# EAGLE design Oraculo V2 (EAGLE 9.4.0)
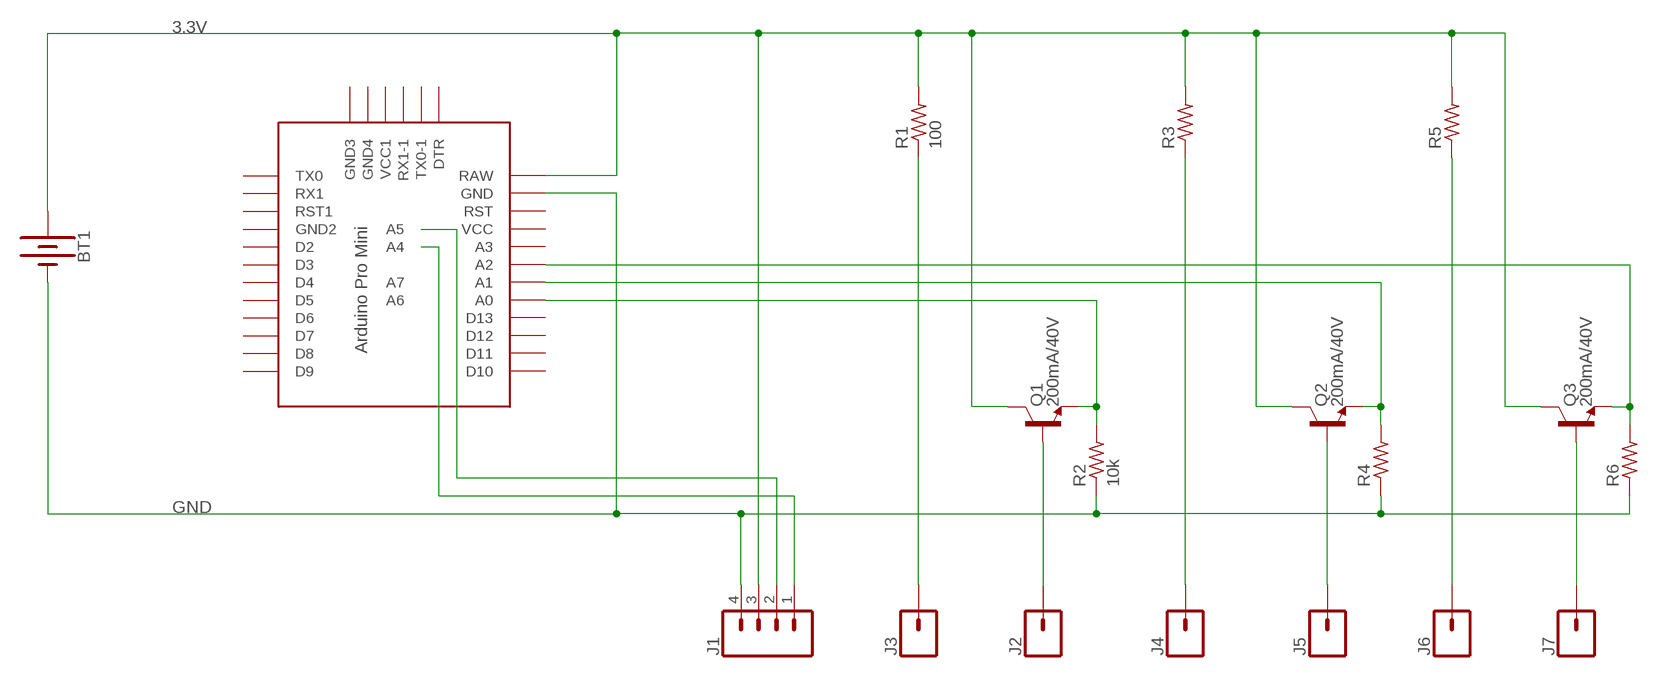
[diagram p0: schematic, sheet 1]

## Parts
BT1  BATTERY-20MM_PTH  [BATTCOM_20MM_PTH]
J1  CONN_04  [1X04]
J2  CONN_01PTH_2MM  [1X01_2MM]
J3  CONN_01PTH_2MM  [1X01_2MM]
J4  CONN_01PTH_2MM  [1X01_2MM]
J5  CONN_01PTH_2MM  [1X01_2MM]
J6  CONN_01PTH_2MM  [1X01_2MM]
J7  CONN_01PTH_2MM  [1X01_2MM]
Q1  200mA/40V  TRANS_NPN-2N3904  [TO-92]
Q2  200mA/40V  TRANS_NPN-2N3904  [TO-92]
Q3  200mA/40V  TRANS_NPN-2N3904  [TO-92]
R1  100  R-US_0204/7  [0204/7]
R2  10k  R-US_0204/7  [0204/7]
R3  R-US_0204/7  [0204/7]
R4  R-US_0204/7  [0204/7]
R5  R-US_0204/7  [0204/7]
R6  R-US_0204/7  [0204/7]
U$1  PRO-MINI-2  [PRO-MINI-2]

## Nets
3.3V: BT1.1(+) J1.3 Q1.3(C) Q2.3(C) Q3.3(C) R1.2 R3.2 R5.2 U$1.RAW
GND: BT1.2(-) J1.4 R2.1 R4.1 R6.1 U$1.GND
N$3: J1.2 U$1.A5
N$4: J1.1 U$1.A4
N$5: Q1.1(E) R2.2 U$1.A0
N$6: J2.1 Q1.2(B)
N$7: J3.1 R1.1
N$8: J4.1 R3.1
N$9: J7.1 Q3.2(B)
N$10: J5.1 Q2.2(B)
N$11: Q2.1(E) R4.2 U$1.A1
N$12: Q3.1(E) R6.2 U$1.A2
N$14: J6.1 R5.1
Unconnected: U$1.A3 U$1.A6 U$1.A7 U$1.D2 U$1.D3 U$1.D4 U$1.D5 U$1.D6 U$1.D7 U$1.D8 U$1.D9 U$1.D10 U$1.D11 U$1.D12 U$1.D13 U$1.DTR U$1.GND1(GND2) U$1.GND2(GND3) U$1.GND3(GND4) U$1.RST U$1.RST1 U$1.RX1 U$1.RX1-1 U$1.TX0 U$1.TX0-1 U$1.VCC U$1.VCC1

## Library data of the parts
BT1 = SparkFun-Batteries:BATTERY: Battery - Single Cell A variety of battery chemistries, sizes, and footprints. Device List: 20MM_PTH - Coin Cell Battery Holder - 20mm (PTH) <https://www.sparkfun.com/products/783> 6.8MM_PTH - Coin Cell Battery Holder - 6.8MM(SMD) <https://www.digikey.com/product-detail/en/seiko-instruments/MS621FE-FL11E/728-1057-ND/1889208?WT.srch=1&gclid=CNOQ5a6LzdQCFZS2wAodXCkE0g> 12MM_SMD - Coin Cell Battery Holder - 12mm (SMD) <https://www.sparkfun.com/products/10592> 12MM_PTH - Coin Cell Battery Holder - 12mm (PTH) <https://www.sparkfun.com/products/7948> 20MM_SMD - 20mm Coin Cell Battery Holder (SMD) (2 legs) Used on the Big Time Watch Kit <https://www.sparkfun.com/products/11734> 20MM_SMD_4LEGS - Coin Cell Battery Holder - 20mm (SMD) <https://www.sparkfun.com/products/11892> 20MM_SMD_4LEGS_OVERPASTE - Coin Cell Battery Holder - 20mm (SMD) <https://www.sparkfun.com/products/11892> (Over-paste on the legs) 24.5MM_PTH - Coin Cell Battery Holder - 24.5mm (PTH) <https://www.sparkfun.com/products/8863> 9V - 9V Battery Holder - PC Mount Used on the SparkFun SparkPunk Sound Kit <https://www.sparkfun.com/products/11177> and SparkFun SparkPunk Sequencer Kit <https://www.sparkfun.com/products/12707> 18650 - Battery Holder - 18650 (PTH) <https://www.sparkfun.com/products/13113> AA - Battery Holder - 1xAA (PTH) <https://www.sparkfun.com/products/7949> AAA - Battery Holder - 1xAAA (PTH) <https://www.sparkfun.com/products/12718> AA_KIT - Battery Holder - 1xAA (PTH) <https://www.sparkfun.com/products/7949> Special kit package - pads only have exposed copper on one side of the board. AAA_KIT - Battery Holder - 1xAAA (PTH) <https://www.sparkfun.com/products/12718> Special kit package - pads only have exposed copper on one side of the board.; PROD_ID: BATT-09031; SF_SKU: PRT-00783
J1 = SparkFun-Connectors:CONN_04: Multi connection point. Often used as Generic Header-pin footprint for 0.1 inch spaced/style header connections On any of the 0.1 inch spaced packages, you can populate with these: Break Away Headers - Straight <https://www.sparkfun.com/products/116> (PRT-00116) Break Away Male Headers - Right Angle <https://www.sparkfun.com/products/553> (PRT-00553) Female Headers <https://www.sparkfun.com/products/115> (PRT-00115) Break Away Headers - Machine Pin <https://www.sparkfun.com/products/117> (PRT-00117) Break Away Female Headers - Swiss Machine Pin <https://www.sparkfun.com/products/743> (PRT-00743) For SCREWTERMINALS and SPRING TERMINALS visit here: Screw Terimnals on SparkFun.com <https://www.sparkfun.com/search/results?term=Screw+Terminals> (5mm/3.5mm/2.54mm spacing) This device is also useful as a general connection point to wire up your design to another part of your project. Our various solder wires solder well into these plated through hole pads. Hook-Up Wire - Assortment (Stranded, 22 AWG) <https://www.sparkfun.com/products/11375> (PRT-11375) Hook-Up Wire - Assortment (Solid Core, 22 AWG) <https://www.sparkfun.com/products/11367> (PRT-11367) View the entire wire category on our website here <https://www.sparkfun.com/categories/141> Special notes: Molex polarized connector foot print use with SKU : PRT-08231 with associated crimp pins and housings. 1MM SMD Version SKU: PRT-10208; PROD_ID: CONN-09696
J2-J7 = SparkFun-Connectors:CONN_01: Single connection point. Often used as Generic Header-pin footprint for 0.1 inch spaced/style header connections On any of the 0.1 inch spaced packages, you can populate with these: Break Away Headers - Straight <https://www.sparkfun.com/products/116> (PRT-00116) Break Away Male Headers - Right Angle <https://www.sparkfun.com/products/553> (PRT-00553) Female Headers <https://www.sparkfun.com/products/115> (PRT-00115) Break Away Headers - Machine Pin <https://www.sparkfun.com/products/117> (PRT-00117) Break Away Female Headers - Swiss Machine Pin <https://www.sparkfun.com/products/743> (PRT-00743) This device is also useful as a general connection point to wire up your design to another part of your project. Our various solder wires solder well into these plated through hole pads. Hook-Up Wire - Assortment (Stranded, 22 AWG) <https://www.sparkfun.com/products/11375> (PRT-11375) Hook-Up Wire - Assortment (Solid Core, 22 AWG) <https://www.sparkfun.com/products/11367> (PRT-11367) View the entire wire category on our website here <https://www.sparkfun.com/categories/141> Special notes: SMTSO-256-ET is a "flush mount" nut for a 4-40 screw. We mostly use this on specialty testbeds; it is a nice way to connect hardware to your PCB at an adjustable hieght. Also note, the SNAP packages are for using a snappable style connector. We sell a baggie of snaps and they are also used on two LilyPad designs: Snap Assortment - 30 pack (male and female) <https://www.sparkfun.com/products/11347> (DEV-11347) LilyPad Arduino SimpleSnap <https://www.sparkfun.com/products/10941> (DEV-10941) LilyPad SimpleSnap Protoboard <https://www.sparkfun.com/products/10940> (DEV-10940)
Q1-Q3 = SparkFun-DiscreteSemi:TRANS_NPN: NPN transistor Current controlled devices typically used to amplify current or used as a switch. BC547 - COM-08928 <http://www.sparkfun.com/products/8928> (TO-92 45V 100mA) (1.Collector 2.Base 3.Emitter) 2N3904 - COM-00521 <http://www.sparkfun.com/products/521> (TO-92 40V 200mA) (1.Emitter 2.Base 3.Collector) P2N2222A - COM-12852 <http://www.sparkfun.com/products/12852> (TO-92 40V 600mA) (1.Collector 2.Base 3.Emitter); PROD_ID: TRANS-08447
R1-R6 = rcl:R-US_: RESISTOR, American symbol; SPICEPREFIX: R
U$1 = Arduino-clone:PRO-MINI-2: Arduino Pro Mini Layout 2 Sparkfun.com

## Board
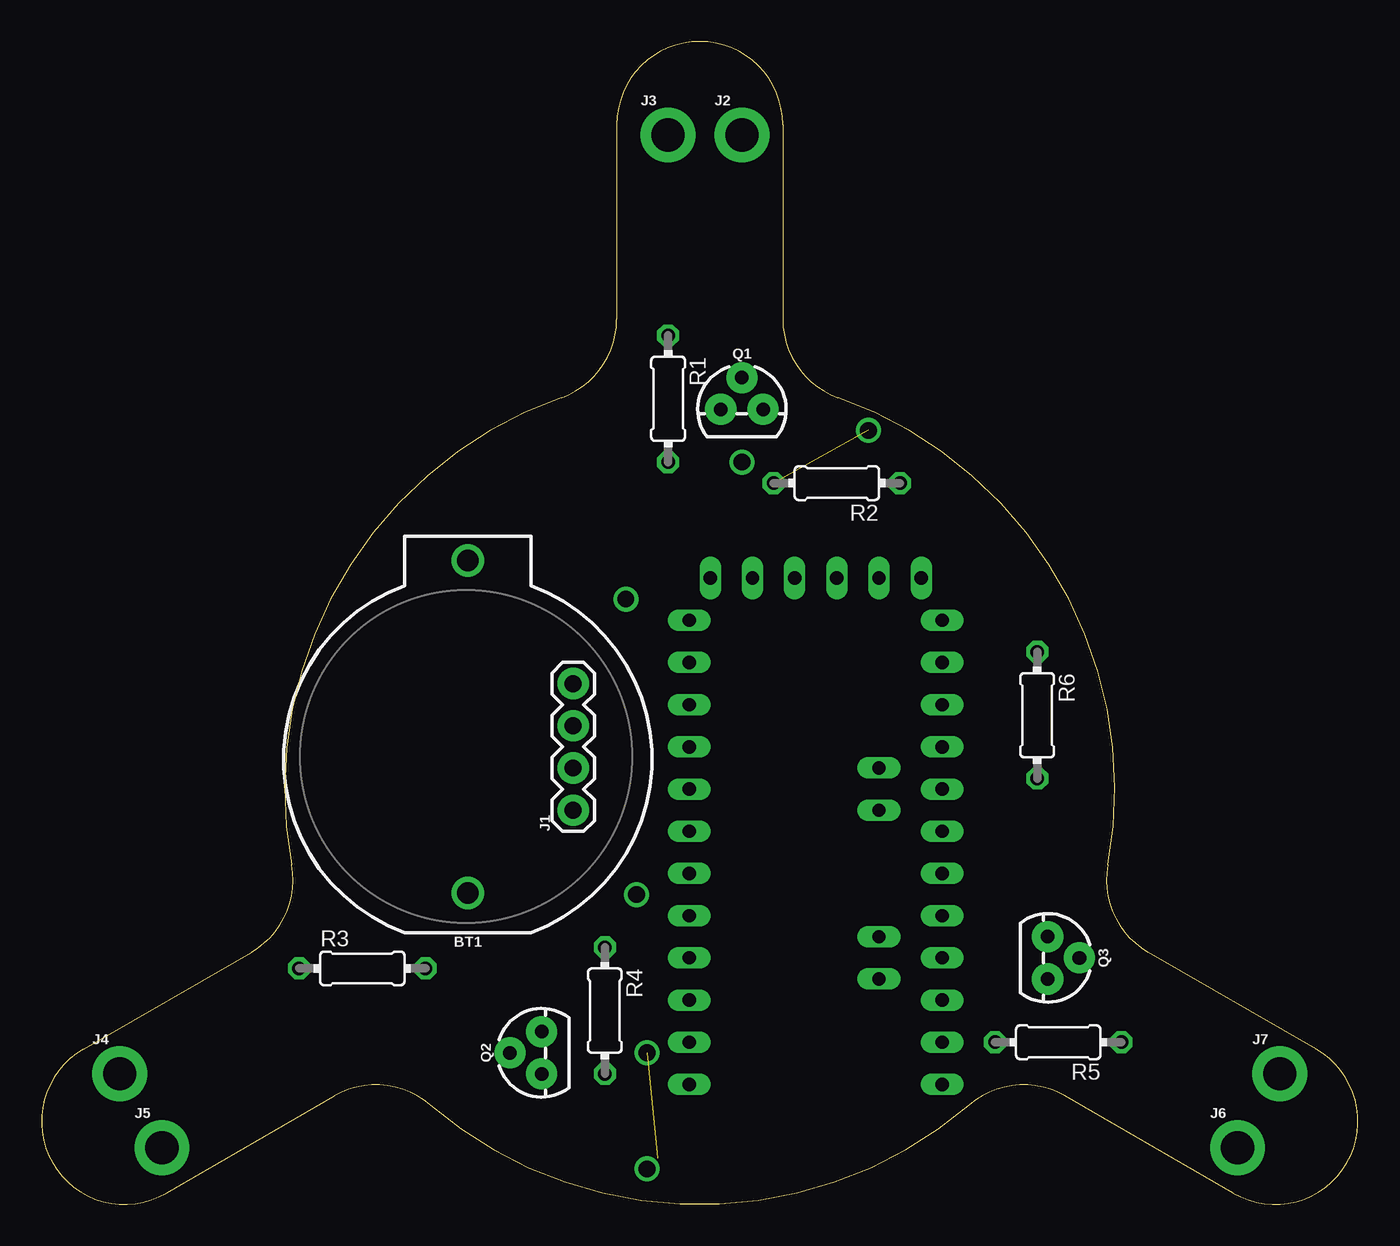
[diagram p1: board, top side]
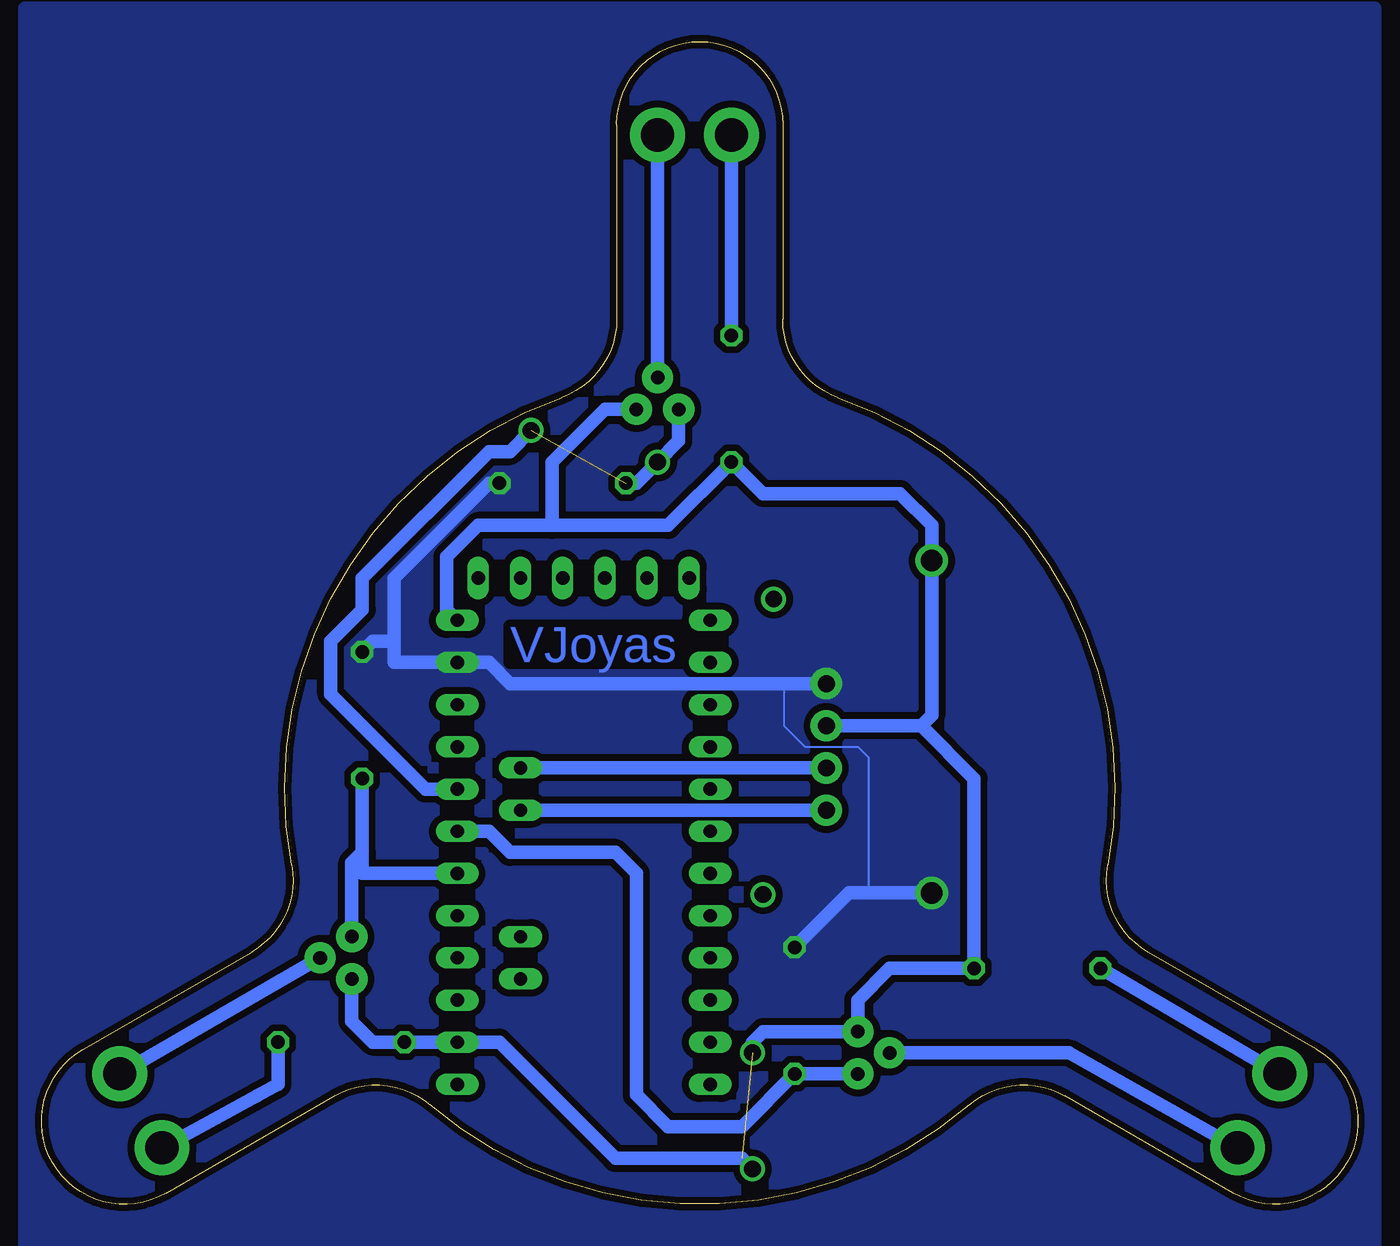
[diagram p2: board, bottom side, seen from below]

Size 79.28 x 70 mm. Coordinates in mm from the lower left corner, seen from the top.
Outline: 31.31,48.57 arc81 15.06,20.43 arc-71 12.64,15.19 2.5,9.33 arc180 7.5,0.67 17.64,6.53 arc-71 23.39,6 arc81 55.88,6 arc-71 61.63,6.53 71.78,0.67 arc180 76.78,9.33 66.63,15.19 arc-71 64.22,20.43 arc81 47.97,48.57 arc-71 44.64,53.28 44.64,65 arc180 34.64,65 34.64,53.28 arc-71 31.31,48.57
Copper layers (1*16): Top 0.035mm / dielectric 1.5mm / Bottom 0.035mm
Design rules "default *": minimum track width 32mil, minimum drill 0.35mm, track to track 8mil, track to pad 8mil, pad to pad 8mil, via to via 8mil, smd to smd 8mil, copper to edge 16mil, drill to drill 32mil, minimum pad ring 10mil, minimum via ring 8mil, stop-mask expansion 4mil, vias tented up to drill 0mil, thermal gap 10mil

### Footprints (pad centres in the part's own frame; a part is rotated, then mirrored left to right if it is on the bottom)
BATTCOM_20MM_PTH = drill 1.3: 1 11.85,0; 2 -8.15,0
1X04 = drill 1.016 pad 1.88: 1 0,0; 2 2.54,0; 3 5.08,0; 4 7.62,0
1X01_2MM = drill 2 pad 3.302: 1 0,0
TO-92 = drill 0.813 pad 1.88: 1 -1.27,0; 2 0,1.905; 3 1.27,0
0204/7 = drill 0.813 octagon: 1 -3.81,0; 2 3.81,0
PRO-MINI-2 = drill 0.8 long: A0 6.35,2.54; A1 6.35,0; A2 6.35,-2.54; A3 6.35,-5.08; A4 2.54,1.27; A5 2.54,3.81; A6 2.54,-8.89; A7 2.54,-6.35; D2 -8.89,2.54; D3 -8.89,0; D4 -8.89,-2.54; D5 -8.89,-5.08; D6 -8.89,-7.62; D7 -8.89,-10.16; D8 -8.89,-12.7; D9 -8.89,-15.24; D10 6.35,-15.24; D11 6.35,-12.7; D12 6.35,-10.16; D13 6.35,-7.62; DTR 5.08,15.24; GND 6.35,10.16; GND1 -8.89,5.08; GND2 -7.62,15.24; GND3 -5.08,15.24; RAW 6.35,12.7; RST 6.35,7.62; RST1 -8.89,7.62; RX1 -8.89,10.16; RX1-1 0,15.24; TX0 -8.89,12.7; TX0-1 2.54,15.24; VCC 6.35,5.08; VCC1 -2.54,15.24

### Placement (x,y rotation side)
BT1  25.67,26.9 90 top
J1  32.02,23.73 90 top
J2  42.18,64.37 0 top
J3  37.73,64.37 0 top
J4  4.71,7.85 0 top
J5  7.25,3.41 0 top
J6  72.02,3.41 0 top
J7  74.56,7.85 0 top
Q1  42.18,47.86 0 top
Q2  30.11,9.12 90 top
Q3  60.59,14.84 270 top
R1  37.73,48.49 270 top
R2  47.89,43.41 180 top
R3  19.32,14.2 0 top
R4  33.92,11.66 270 top
R5  61.23,9.76 180 top
R6  59.96,29.44 270 top
U$1  47.89,22.46 0 top

### Tracks (layer width: path | path; a pad name or v marks a point on that pad's centre or on a via)
3.3V  (via drill 1)  (1 unrouted)
  Bottom 0.813: 48.53,40.87 41.54,40.87 R1.2 35.83,42.78 27.57,42.78 25.67,40.87 BT1.1 25.67,29.44 26.3,28.81 | 48.53,40.87 52.97,40.87 54.88,38.97 54.88,35.79 U$1.RAW | Q3.3 60.59,11.03 59.32,9.76 R5.2 51.7,9.76 44.72,2.77 37.1,2.77 v36.46,2.14 | 26.3,28.81 23.13,25.63 R3.2 28.21,14.2 30.11,12.3 Q2.3 35.83,10.39 36.46,9.76 v36.46,9.12 | 26.3,28.81 J1.3 | Q1.3 45.35,47.86 48.53,44.68 48.53,40.87
GND
  Bottom 0.127: 34.56,31.35 34.56,28.81 33.29,27.54 30.11,27.54 29.48,26.9 29.48,18.75
  Bottom 0.813: BT1.2 29.48,18.75 30.64,18.75 R4.1 | R6.1 59.32,33.89 58.05,33.89 | R2.1 52.34,43.41 58.05,37.7 58.05,33.89 | 58.05,33.89 58.05,32.62 U$1.GND 52.34,32.62 51.07,31.35 34.56,31.35 J1.4
  pour Bottom (isolate 0.406, no thermals): -1,-5.48 -1,71.99 80.28,71.99 80.28,-5.48
N$1  (via drill 1)
  other vias: 35.19,36.43
N$2  (via drill 1)
  other vias: 35.83,18.65
N$3
  Bottom 0.813: J1.2 U$1.A5
N$4
  Bottom 0.813: J1.1 U$1.A4
N$5  (via drill 1)  (1 unrouted)
  Bottom 0.813: Q1.1 40.91,45.95 v42.18,44.68 43.45,43.41 R2.2 | U$1.A0 56.15,25 61.86,30.71 61.86,33.89 59.96,35.79 59.96,37.7 52.34,45.32 51.07,45.32 v49.8,46.59
N$6
  Bottom 0.813: J2.1 Q1.2
N$7
  Bottom 0.813: J3.1 R1.1
N$8
  Bottom 0.813: J4.1 R3.1
N$9
  Bottom 0.813: J7.1 Q3.2
N$10
  Bottom 0.813: J5.1 17.41,9.12 Q2.2
N$11
  Bottom 0.813: Q2.1 R4.2 37.1,4.68 41.54,4.68 43.45,6.58 43.45,19.92 44.72,21.19 51.07,21.19 52.34,22.46 U$1.A1
N$12
  Bottom 0.813: U$1.A2 59.96,19.92 59.96,21.19 | 59.96,21.19 R6.2 | 59.96,21.19 60.59,20.55 Q3.1
N$14
  Bottom 0.813: J6.1 66.28,6.54 65.04,7.22 R5.1

### Text on the board
Bottom: VJoyas